# EAGLE design IO_Bottom_Board (EAGLE 9.0.0)
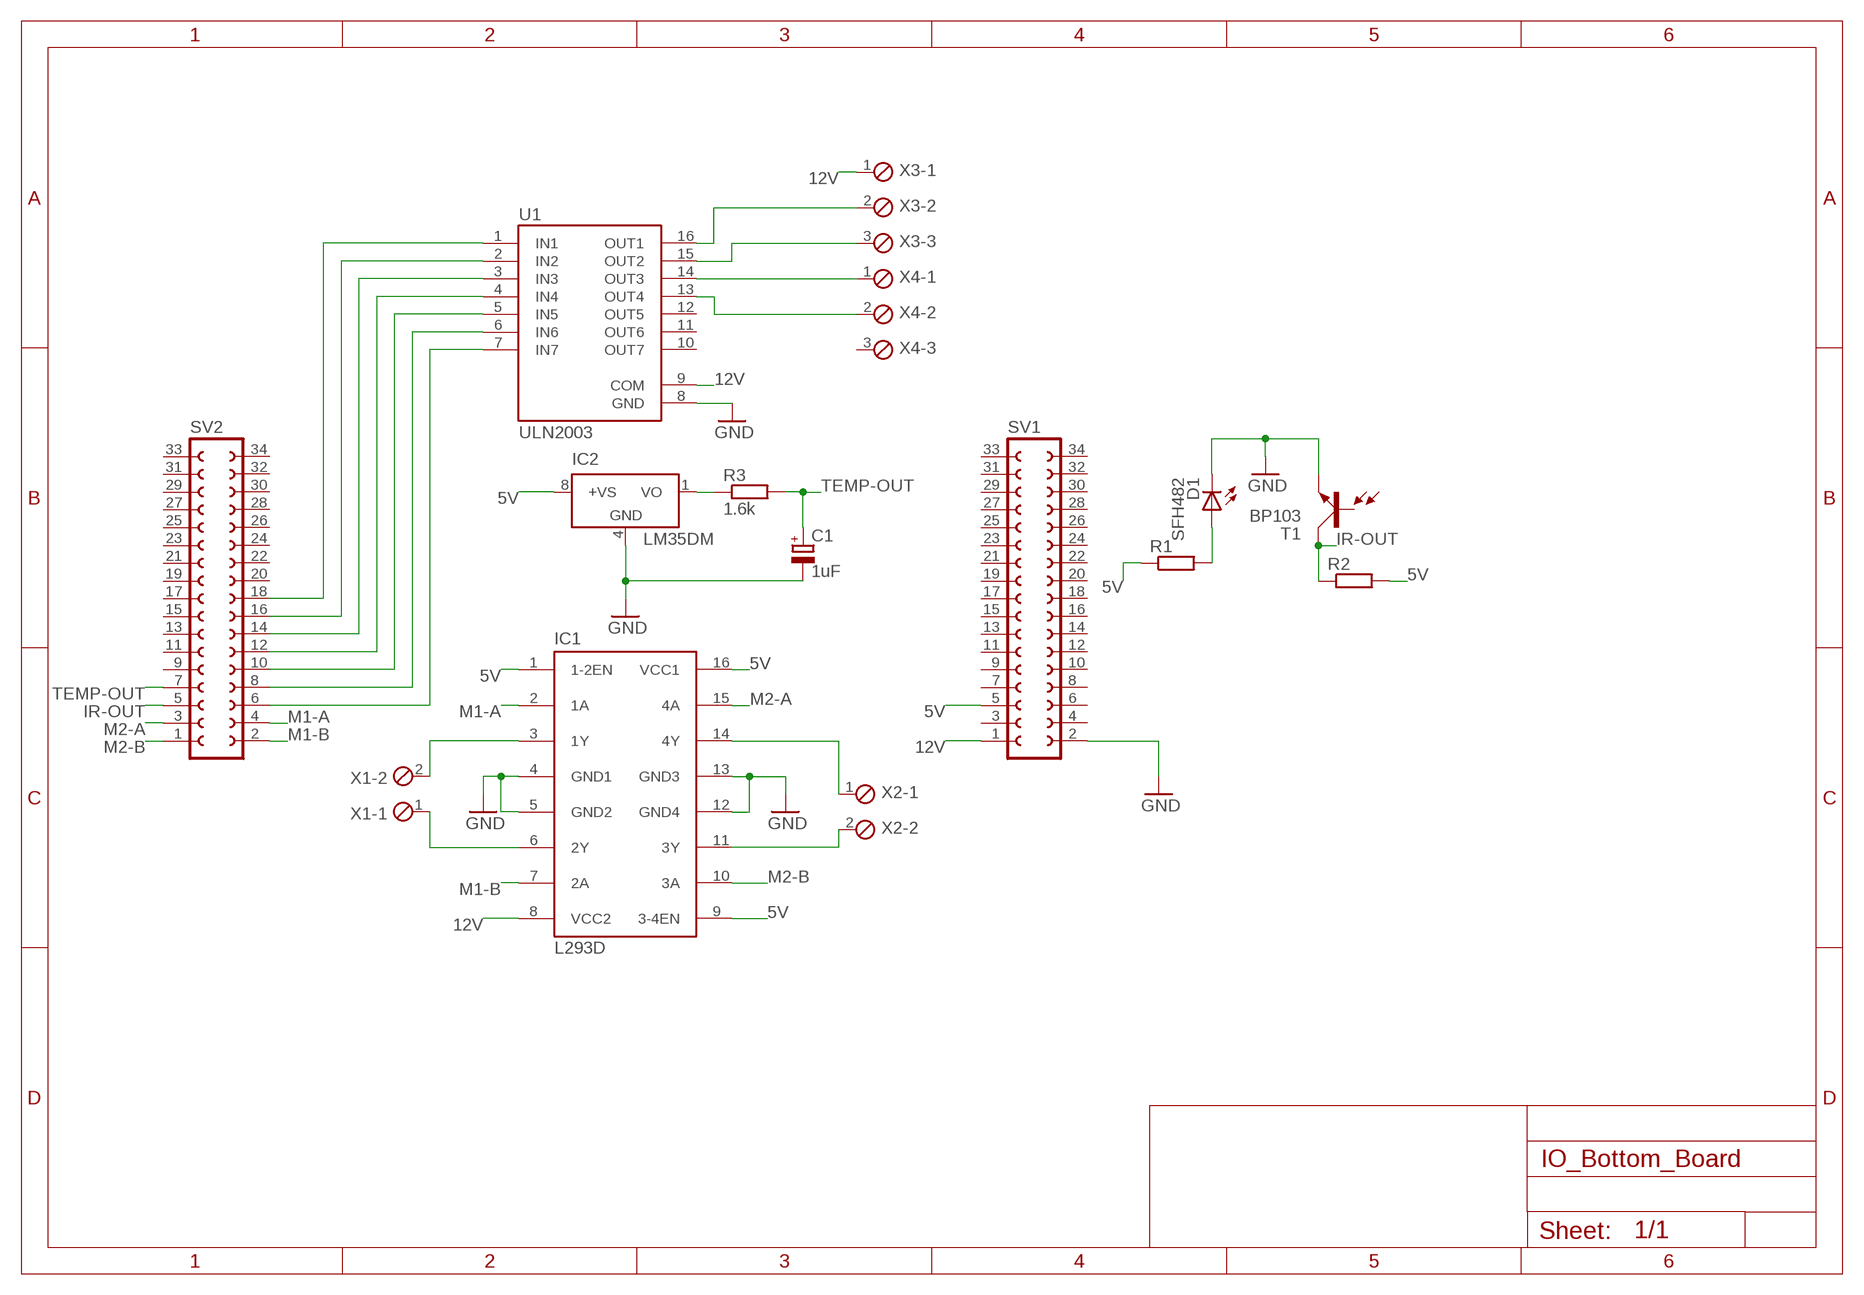
[diagram p0: schematic, sheet 1]

## Parts
C1  1uF  CPOL-EUCT3528  [CT3528]
D1  SFH482  [SFH482]
IC1  L293D  [DIL16]
IC2  LM35DM  [SO08]
R1  R-EU_M2012  [M2012]
R2  R-EU_M2012  [M2012]
R3  1.6k  R-EU_M2012  [M2012]
SV1  FE17-2W  [FE17-2W]
SV2  FE17-2W  [FE17-2W]
T1  BP103  [BP103]
U1  ULN2003  [DIP762W46P254L1969H533Q16]
X1  MPT2  [2POL254]
X2  MPT2  [2POL254]
X3  MPT3  [3POL254]
X4  MPT3  [3POL254]

## Nets
5V: IC1.1(1-2EN) IC1.9(3-4EN) IC1.16(VCC1) IC2.8(+VS) R1.1 R2.2 SV1.5
12V: IC1.8(VCC2) SV1.1 U1.9(COM) X3.1
GND: C1.- D1.K(C) IC1.4(GND1) IC1.5(GND2) IC1.12(GND4) IC1.13(GND3) IC2.4(GND) SV1.2 T1.E U1.8(GND)
IR-OUT: R2.1 SV2.5 T1.C
LM-OUT: IC2.1(VO) R3.1
M1-A: IC1.2(1A) SV2.4
M1-B: IC1.7(2A) SV2.2
M2-A: IC1.15(4A) SV2.3
M2-B: IC1.10(3A) SV2.1
N$1: IC1.3(1Y) X1.2
N$2: IC1.6(2Y) X1.1
N$3: IC1.14(4Y) X2.1
N$4: IC1.11(3Y) X2.2
N$5: SV2.6 U1.7(IN7)
N$6: SV2.8 U1.6(IN6)
N$7: SV2.10 U1.5(IN5)
N$8: SV2.12 U1.4(IN4)
N$9: SV2.14 U1.3(IN3)
N$10: SV2.16 U1.2(IN2)
N$11: SV2.18 U1.1(IN1)
N$12: U1.16(OUT1) X3.2
N$13: U1.15(OUT2) X3.3
N$14: U1.14(OUT3) X4.1
N$15: U1.13(OUT4) X4.2
N$16: D1.A R1.2
TEMP-OUT: C1.+ R3.2 SV2.7
Unconnected: SV1.3 SV1.4 SV1.6 SV1.7 SV1.8 SV1.9 SV1.10 SV1.11 SV1.12 SV1.13 SV1.14 SV1.15 SV1.16 SV1.17 SV1.18 SV1.19 SV1.20 SV1.21 SV1.22 SV1.23 SV1.24 SV1.25 SV1.26 SV1.27 SV1.28 SV1.29 SV1.30 SV1.31 SV1.32 SV1.33 SV1.34 SV2.9 SV2.11 SV2.13 SV2.15 SV2.17 SV2.19 SV2.20 SV2.21 SV2.22 SV2.23 SV2.24 SV2.25 SV2.26 SV2.27 SV2.28 SV2.29 SV2.30 SV2.31 SV2.32 SV2.33 SV2.34 T1.B U1.10(OUT7) U1.11(OUT6) U1.12(OUT5) X4.3

## Library data of the parts
C1 = rcl:CPOL-EU: POLARIZED CAPACITOR, European symbol; SPICEPREFIX: C
D1 = led:SFH482: IR LED infrared emitting diode, Infineon
IC1 = st-microelectronics:L293D: PUSH-PULL 4 CHANNEL DRIVER; MPN: L293D; OC_FARNELL: 9589619; OC_NEWARK: 56P8249
IC2 = lm35:LM35: Single-Supply Centigrade Temperature Sensor Vout = (10mV/°C x Temp °C) +5mmmV Source: http://www.national.com/ds/LM/LM35.pdf; SPICEPREFIX: J
R1-R3 = rcl:R-EU_: RESISTOR, European symbol; SPICEPREFIX: R
SV1 SV2 = con-lsta:FE17-2W: FEMALE HEADER; OC_FARNELL: unknown; OC_NEWARK: unknown
T1 = opto-trans-siemens:BP103: PHOTO TRANSISTOR; OC_FARNELL: unknown; OC_NEWARK: unknown
U1 = ULN2003:ULN2003: Seven Darlington array; AVAILABILITY: Unavailable; DESCRIPTION: SMD/Our stock Madrid-New & Original; MF: STMicroelectronics; MP: ULN2003; PACKAGE: None; PRICE: None
X1 X2 = con-phoenix-254:MPT2: PHOENIX CONNECTOR; OC_FARNELL: unknown; OC_NEWARK: unknown
X3 X4 = con-phoenix-254:MPT3: PHOENIX CONNECTOR; OC_FARNELL: unknown; OC_NEWARK: unknown

## Board
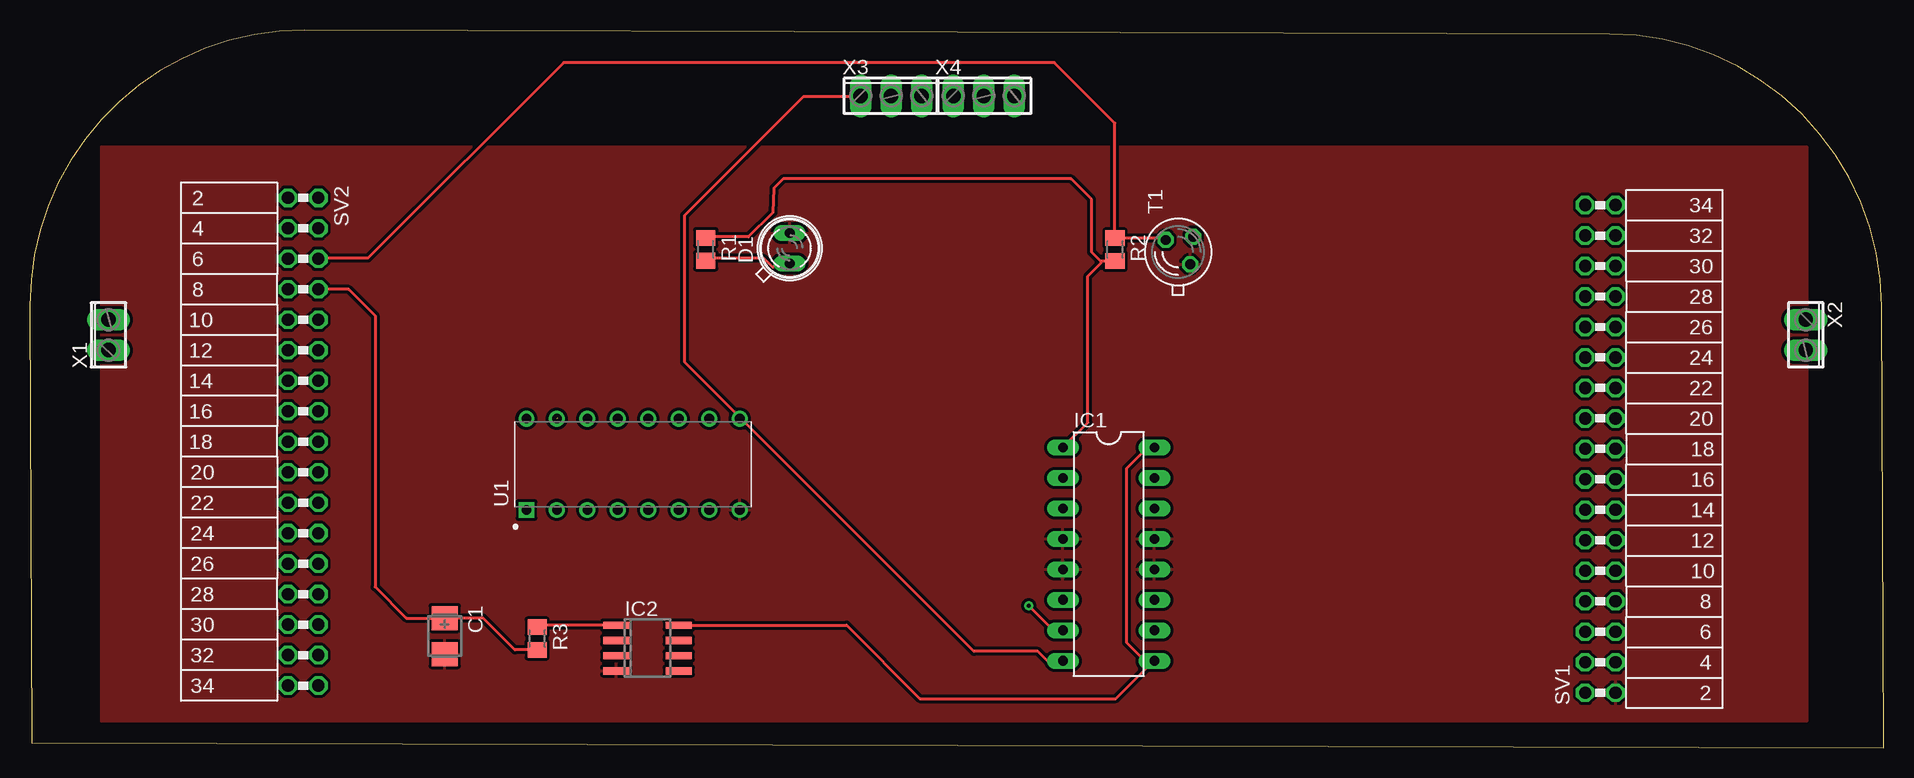
[diagram p1: board, top side]
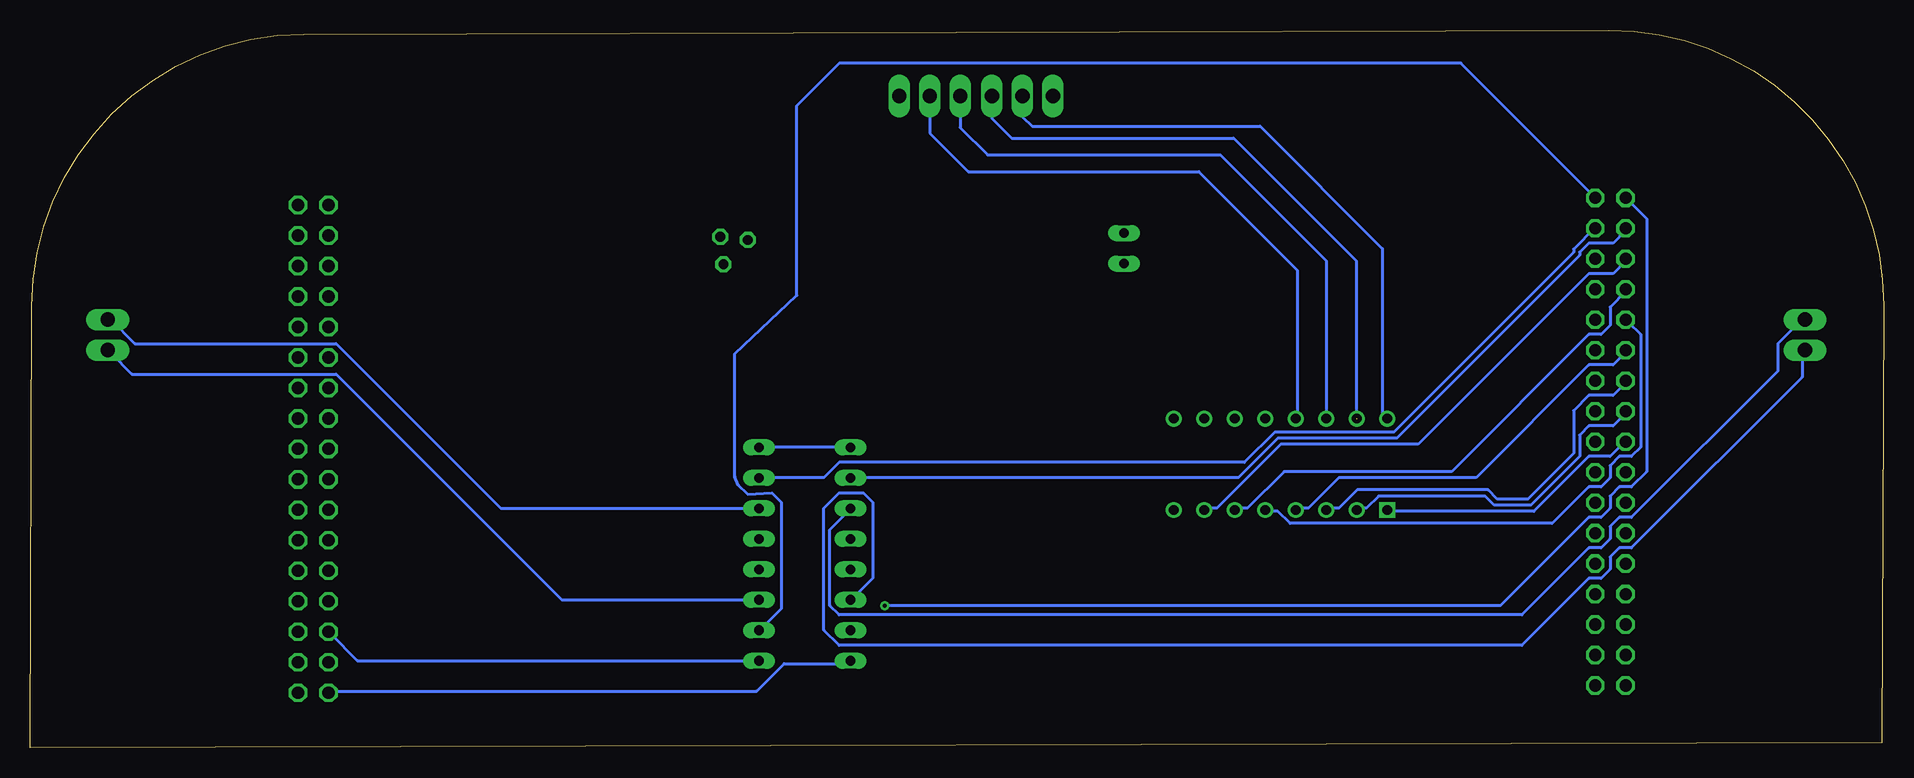
[diagram p2: board, bottom side, seen from below]

Size 154.46 x 59.81 mm. Coordinates in mm from the lower left corner, seen from the top.
Outline: 0.16,0.4 154.46,0 154.3,36.84 arc90 131.63,59.47 22.91,59.81 arc90 0,36.87 0.16,0.4
Copper layers (1*16): Top 0.035mm / dielectric 1.5mm / Bottom 0.035mm
Design rules "default *": minimum track width 10mil, minimum drill 0.35mm, track to track 10mil, track to pad 10mil, pad to pad 10mil, via to via 10mil, smd to smd 6mil, copper to edge 20mil, drill to drill 6mil, minimum pad ring 10mil, minimum via ring 8mil, stop-mask expansion 4mil, vias tented up to drill 0mil, thermal gap 10mil

### Footprints (pad centres in the part's own frame; a part is rotated, then mirrored left to right if it is on the bottom)
CT3528 = smd 2 x 2.2: + -1.5,0; - 1.5,0
SFH482 = drill 0.813 long: A -1.27,0; K 1.27,0
DIL16 = drill 0.813 long: 1 -8.89,-3.81; 2 -6.35,-3.81; 3 -3.81,-3.81; 4 -1.27,-3.81; 5 1.27,-3.81; 6 3.81,-3.81; 7 6.35,-3.81; 8 8.89,-3.81; 9 8.89,3.81; 10 6.35,3.81; 11 3.81,3.81; 12 1.27,3.81; 13 -1.27,3.81; 14 -3.81,3.81; 15 -6.35,3.81; 16 -8.89,3.81
SO08 = smd 0.6 x 2.2: 1 -1.905,-2.6; 2 -0.635,-2.6; 3 0.635,-2.6; 4 1.905,-2.6; 5 1.905,2.6; 6 0.635,2.6; 7 -0.635,2.6; 8 -1.905,2.6
M2012 = smd 1.3 x 1.6: 1 -0.95,0; 2 0.95,0
FE17-2W = drill 1.016 octagon: 1 -20.32,1.27; 2 -20.32,-1.27; 3 -17.78,1.27; 4 -17.78,-1.27; 5 -15.24,1.27; 6 -15.24,-1.27; 7 -12.7,1.27; 8 -12.7,-1.27; 9 -10.16,1.27; 10 -10.16,-1.27; 11 -7.62,1.27; 12 -7.62,-1.27; 13 -5.08,1.27; 14 -5.08,-1.27; 15 -2.54,1.27; 16 -2.54,-1.27; 17 0,1.27; 18 0,-1.27; 19 2.54,1.27; 20 2.54,-1.27; 21 5.08,1.27; 22 5.08,-1.27; 23 7.62,1.27; 24 7.62,-1.27; 25 10.16,1.27; 26 10.16,-1.27; 27 12.7,1.27; 28 12.7,-1.27; 29 15.24,1.27; 30 15.24,-1.27; 31 17.78,1.27; 32 17.78,-1.27; 33 20.32,1.27; 34 20.32,-1.27
BP103 = drill 0.813 octagon: B 1.27,-1.27; C 1.016,1.016; E -1.016,-1.016
DIP762W46P254L1969H533Q16 = drill 0.82 square: 1 -3.81,8.89 | drill 0.82: 2 -3.81,6.35; 3 -3.81,3.81; 4 -3.81,1.27; 5 -3.81,-1.27; 6 -3.81,-3.81; 7 -3.81,-6.35; 8 -3.81,-8.89; 9 3.81,-8.89; 10 3.81,-6.35; 11 3.81,-3.81; 12 3.81,-1.27; 13 3.81,1.27; 14 3.81,3.81; 15 3.81,6.35; 16 3.81,8.89
2POL254 = drill 1.2 long: 1 -1.27,0; 2 1.27,0
3POL254 = drill 1.2 long: 1 -2.54,0; 2 0,0; 3 2.54,0

### Placement (x,y rotation side)
C1  34.56,9.3 270 top
D1  63.3,41.62 90 top
IC1  89.89,16.13 270 top
IC2  51.46,8.3 270 top
R1  56.31,41.53 270 top
R2  90.41,41.51 270 top
R3  42.26,9.1 270 top
SV1  130.86,24.9 90 top
SV2  22.76,25.5 270 top
T1  95.66,41.3 90 top
U1  50.26,23.62 90 top
X1  6.54,34.4 90 top
X2  147.98,34.4 270 top
X3  71.76,54.32 0 top
X4  79.48,54.32 0 top

### Tracks (layer width: path | path; a pad name or v marks a point on that pad's centre or on a via)
5V
  Top 0.254: R1.1 56.56,42.56 59.87,42.56 61.9,44.6 62,46.64 62.76,47.4 86.76,47.4 88.46,45.7 88.46,41.3 89.2,40.56 89.26,40.56 | 86.28,25.04 IC1.1 88.16,27.1 88.16,39.3 89.26,40.4 89.26,40.56 | 93.65,7.26 92.89,7.26 91.36,8.78 91.36,23.26 92.89,24.78 93.65,24.78 IC1.16 | 93.65,7.26 IC1.9 | IC2.8 68.06,10.21 74.16,4.1 90.49,4.1 93.65,7.26 | 89.26,40.56 R2.2
  Bottom 0.254: IC1.9 93.9,7.26 127.18,7.26 129.46,9.54 SV1.5 | IC1.16 93.65,25.04 86.28,25.04 IC1.1
12V
  Top 0.254: X3.1 69.01,54.25 64.44,54.25 54.53,44.34 54.53,32.15 59.1,27.58 U1.9 59.36,27.32 78.66,8.02 84,8.02 84.76,7.26 86.03,7.26 IC1.8
  Bottom 0.254: IC1.8 86.28,7 91.62,7 93.9,4.72 129.46,4.72 SV1.1
GND
  pour Top: 5.96,50.1 148.06,50.1 148.06,2.2 5.96,2.2
IR-OUT
  Top 0.254: T1.C 94.5,42.46 R2.1 90.41,52.05 85.36,57.1 44.46,57.1 28.16,40.8 24.09,40.8 SV2.5
LM-OUT
  Top 0.254: IC2.1 42.42,10.21 R3.1
M1-A
  Bottom 0.254: IC1.2 86.03,22.5 53.77,22.5 50.47,25.8 40.56,25.8 25.32,41.04 25.32,41.29 24.56,42.06 22.53,42.06 21.51,43.07 SV2.4
M1-B  (via drill 0.35)
  Top 0.254: v83.23,11.83 85.27,9.8 86.03,9.8 IC1.7
  Bottom 0.254: v83.23,11.83 31.93,11.83 24.56,19.2 23.54,19.2 22.78,19.96 22.78,20.97 22.02,21.74 21,21.74 19.73,23.01 19.73,44.09 21.26,45.61 SV2.2
M2-A
  Bottom 0.254: IC1.15 93.65,22.5 88.31,22.5 87.04,23.77 53.26,23.77 50.72,26.31 40.82,26.31 25.83,41.29 25.83,41.55 24.05,43.33 SV2.3
M2-B
  Bottom 0.254: IC1.10 93.65,9.8 91.87,11.58 91.87,20.47 92.63,21.23 94.66,21.13 95.43,21.89 95.73,22.6 95.73,32.84 90.56,37.7 90.56,53.5 87.02,57.04 35.23,57.04 24.05,45.87 SV2.1
N$1
  Bottom 0.254: IC1.3 86.28,19.7 87.81,18.18 87.81,11.83 87.04,11.07 30.15,11.07 24.56,16.66 23.54,16.66 22.78,17.42 22.78,18.43 22.02,19.2 21,19.2 8.81,31.39 8.81,33.67 6.78,35.71 X1.2
N$2
  Bottom 0.254: IC1.6 86.03,12.34 84.25,14.12 84.25,20.47 85.01,21.23 87.04,21.23 88.31,19.96 88.31,9.8 87.04,8.53 30.15,8.53 24.56,14.12 23.54,14.12 22.78,14.88 22.78,15.89 22.02,16.66 21,16.66 6.78,30.88 6.78,32.91 X1.1
N$3
  Bottom 0.254: IC1.14 93.9,19.96 115.24,19.96 128.95,33.67 145.72,33.67 147.75,35.71 X2.1
N$4
  Bottom 0.254: IC1.11 93.9,12.34 110.16,12.34 128.95,31.13 145.97,31.13 147.75,32.91 X2.2
N$5
  Bottom 0.254: U1.7 56.56,19.96 55.55,19.96 50.21,25.29 38.78,25.29 24.56,39.52 22.53,39.52 21.51,40.53 SV2.6
N$6
  Bottom 0.254: U1.6 54.02,19.96 53.01,19.96 49.96,23.01 35.99,23.01 24.56,34.44 23.54,34.44 22.78,35.2 22.78,36.72 21.51,37.99 SV2.8
N$7
  Bottom 0.254: U1.5 51.48,19.7 50.47,19.7 49.45,18.69 27.61,18.69 24.56,21.74 23.54,21.74 22.78,22.5 22.78,23.51 22.02,24.28 21,24.28 20.24,25.04 20.24,34.44 21.26,35.45 SV2.10
N$8
  Bottom 0.254: U1.4 48.94,19.96 47.93,19.96 45.39,22.5 33.96,22.5 24.56,31.9 22.53,31.9 21.51,32.91 SV2.12
N$9
  Bottom 0.254: U1.3 46.4,19.96 45.39,19.96 43.86,21.48 32.94,21.48 32.18,20.72 29.64,20.72 25.83,24.53 25.83,28.09 24.56,29.36 22.53,29.36 21.51,30.37 SV2.14
N$10
  Bottom 0.254: U1.2 43.86,19.96 43.1,19.96 42.09,20.97 33.2,20.97 32.43,20.21 29.39,20.21 25.32,24.28 25.32,26.05 24.56,26.82 22.53,26.82 21.51,27.83 SV2.16
N$11
  Bottom 0.254: U1.1 41.32,19.7 29.13,19.7 24.56,24.28 22.78,24.28 21.51,25.55 SV2.18
N$12
  Bottom 0.254: X3.2 71.76,52.6 70.96,51.8 51.96,51.8 41.76,41.6 41.76,27.82 U1.16
N$13  (1 unrouted)
  Bottom 0.254: X3.3 74.3,52.44 72.66,50.8 54.16,50.8 43.96,40.6 43.96,27.47 43.96,27.46
N$14
  Bottom 0.254: X4.1 76.94,51.68 74.66,49.4 55.26,49.4 46.45,40.59 U1.14
N$15
  Bottom 0.254: X4.2 79.48,51.22 76.26,48 57.06,48 48.86,39.8 48.86,27.56 U1.13
N$16
  Top 0.254: R1.2 56.56,40.79 61.14,40.79 61.9,40.02 62.15,40.28 63.17,40.28 D1.A
TEMP-OUT
  Top 0.254: R3.2 40.41,8.15 37.76,10.8 34.66,10.8 C1.+ 31.36,10.8 28.76,13.4 28.76,36 26.56,38.2 SV2.7